# Altium schematic sheet NB2_EXTEND_A.SchDoc: NB2-Extender A Interface
size A4; Organization: Altium Limited.; Address1: Level 3, 12a Rodborough Rd; Address2: Frenchs Forest 2086; Address3: NSW; Address4: AUSTRALIA; SheetNumber: 1; SheetTotal: 100
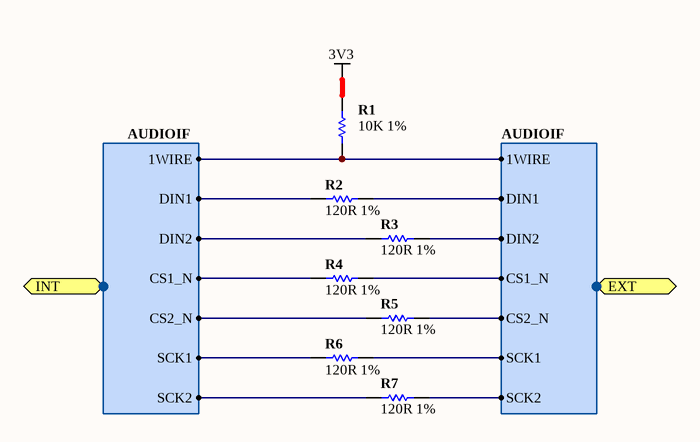
[diagram p0: NB2_EXTEND_A.SchDoc]

## Parts
R1  10K 1%  [RESC1005-STAR]
R2  120R 1%  [RESC1005-STAR]
R3  120R 1%  [RESC1005-STAR]
R4  120R 1%  [RESC1005-STAR]
R5  120R 1%  [RESC1005-STAR]
R6  120R 1%  [RESC1005-STAR]
R7  120R 1%  [RESC1005-STAR]

## Ports
EXT (harness AUDIOIF), INT (harness AUDIOIF)

## Harnesses
AUDIOIF: CS1_N, CS2_N, SCK1, 1WIRE, DIN1, DIN2, SCK2

## Nets
3V3: R1.2
NetR1_1: R1.1 ; port EXT.1WIRE, port INT.1WIRE
NetR2_1: R2.1 ; port INT.DIN1
NetR2_2: R2.2 ; port EXT.DIN1
NetR3_1: R3.1 ; port EXT.DIN2
NetR3_2: R3.2 ; port INT.DIN2
NetR4_1: R4.1 ; port EXT.CS1_N
NetR4_2: R4.2 ; port INT.CS1_N
NetR5_1: R5.1 ; port EXT.CS2_N
NetR5_2: R5.2 ; port INT.CS2_N
NetR6_1: R6.1 ; port INT.SCK1
NetR6_2: R6.2 ; port EXT.SCK1
NetR7_1: R7.1 ; port EXT.SCK2
NetR7_2: R7.2 ; port INT.SCK2

## Notes on the sheet
- Sheet Title
- Project Title
- Size:
- Date:
- A4
- Assy:
- Time:
- Revision:
- Sheet
- of
- File:

## Library data of the parts
R1 = D-100-0130: Resistor, 10K 1% 0402 (1005); Power Rating: 63 mW; Category: Resistor; Mounting Technology: Surface Mount; Resistance: 10 K; Status: Production; Tolerance: 1 %
R2-R7 = D-100-0126: Resistor, 120R 1% 0402 (1005); Power Rating: 63 mW; Category: Resistor; Mounting Technology: Surface Mount; Resistance: 120 R; Status: Production; Tolerance: 1 %